# EAGLE design riser-1u-can (EAGLE 5.06)
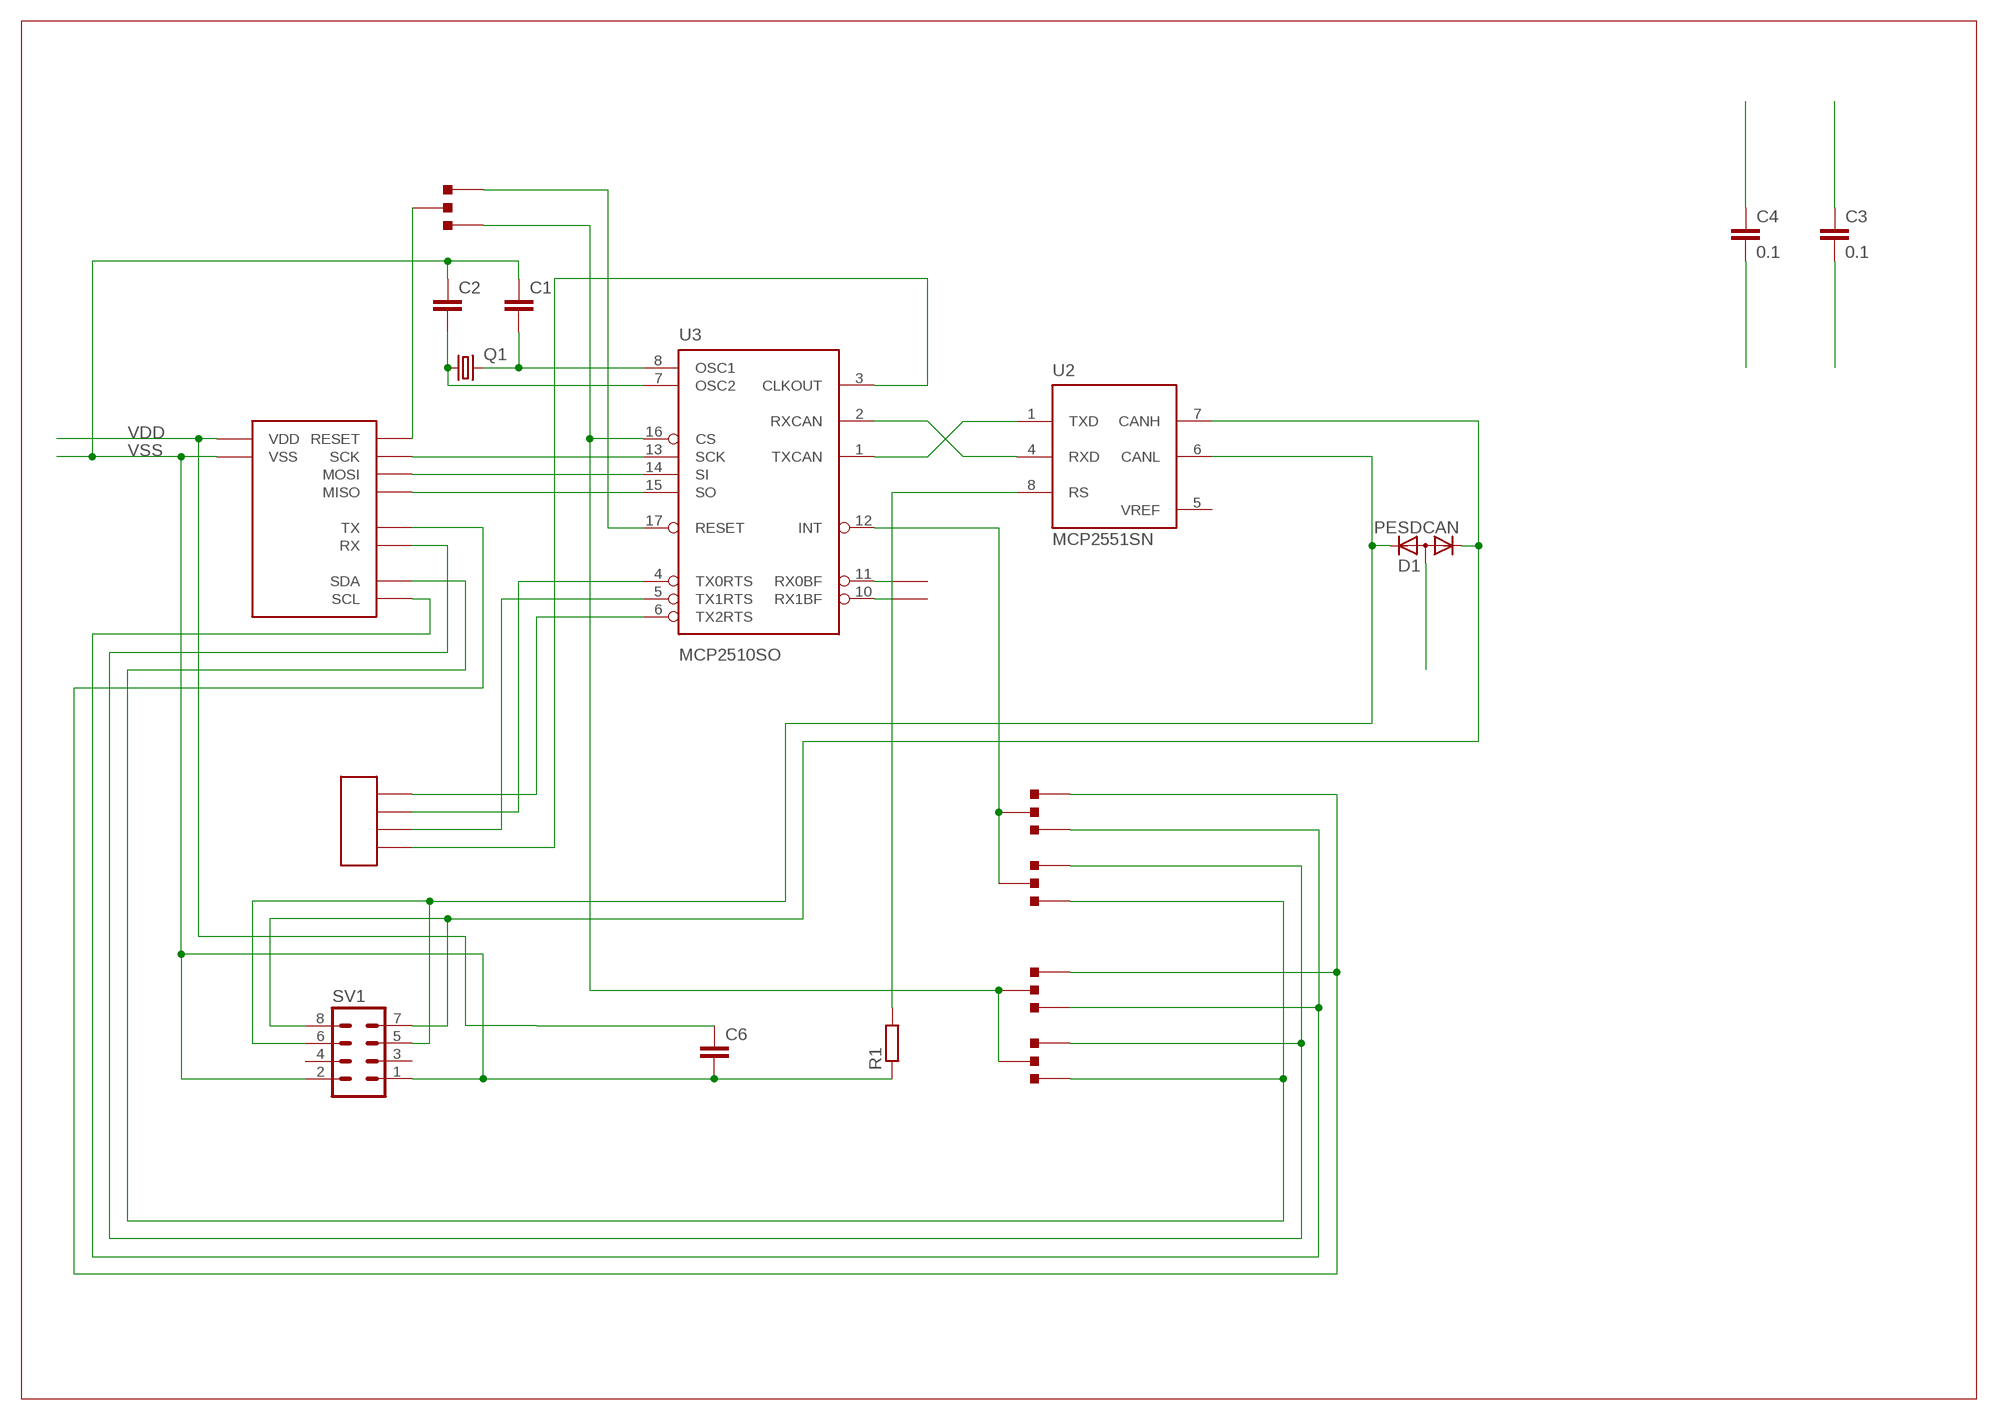
[diagram p0: schematic, sheet 1]

## Parts
C1  C-EUC0805  [C0805]
C2  C-EUC0805  [C0805]
C3  0.1  C-EUC0805  [C0805]
C4  0.1  C-EUC0805  [C0805]
C6  C-EUC1206  [C1206]
D1  PESDCAN  DIODE-2CA|ACSOT23  [SOT23]
Q1  CRYSTALHC49S  [HC49/S]
R1  R-EU_R0603  [R0603]
SV1  MA04-2  [MA04-2]
U2  MCP2551SN  [SO-08]
U3  MCP2510SO  [SO-18W]
U$1  UNI_BOARD_CONNECTOR_10  [UNI_BOARD_CONN_10]
U$2  PIN_HEADER_2X2  [PIN_HEADER_2X2]
U$3  JUMPER3  [JUMPER3]
U$4  JUMPER3  [JUMPER3]
U$5  JUMPER  [JUMPER]
U$7  JUMPER3  [JUMPER3]
U$8  JUMPER3  [JUMPER3]
U$10  JUMPER3  [JUMPER3]

## Nets
CANH: D1.1(K1) SV1.7 SV1.8 U2.7(CANH)
CANL: D1.2(K2) SV1.5 SV1.6 U2.6(CANL)
CS: U3.16(CS) U$7.P$1 U$8.P$1 U$10.P$3
INT: U3.12(INT) U$3.P$1 U$4.P$1
MISO: U3.15(SO) U$1.C$1(MISO)
MOSI: U3.14(SI) U$1.C$4(MOSI)
N$6: C1.2 Q1.2 U3.8(OSC1)
N$7: C2.2 Q1.1 U3.7(OSC2)
N$9: U3.3(CLKOUT) U$2.P$4
N$10: U3.5(TX1RTS) U$2.P$3
N$11: U3.4(TX0RTS) U$2.P$2
N$12: U3.6(TX2RTS) U$2.P$1
N$13: U3.11(RX0BF) U$5.P$1
N$14: U3.10(RX1BF) U$5.P$2
RESET: U$1.C$5(RESET) U$10.P$1
RESET_IN: U3.17(RESET) U$10.P$2
RS: R1.2 U2.8(RS)
RX: U$1.C$9(RX) U$4.P$2 U$8.P$2
RXCAN: U2.4(RXD) U3.2(RXCAN)
SCK: U3.13(SCK) U$1.C$3(SCK)
SCL: U$1.C$10(SCL) U$3.P$3 U$7.P$3
SDA: U$1.C$8(SDA) U$4.P$3 U$8.P$3
TX: U$1.C$7(TX) U$3.P$2 U$7.P$2
TXCAN: U2.1(TXD) U3.1(TXCAN)
VDD: C3.1 C4.1 C6.1 U$1.C$2(VDD)
VSS: C1.1 C2.1 C3.2 C4.2 C6.2 D1.3(A) R1.1 SV1.1 SV1.2 U$1.C$6(VSS)
Unconnected: SV1.3 SV1.4

## Power pins joined to a net without a drawn wire
VDD: U2.3(VDD) U3.18(VDD)
VREF: U2.5(VREF)
VSS: U2.2(VSS) U3.9(VSS)

## Library data of the parts
C1-C4 C6 = rcl:C-EU: CAPACITOR, European symbol
D1 = diode:DIODE-2CA|AC: Dual DIODE Cathode-Anode|Anode-Cathode
Q1 = crystal:CRYSTAL: CRYSTAL
R1 = rcl:R-EU_: RESISTOR, European symbol
SV1 = con-lstb:MA04-2: PIN HEADER
U2 = microchip_can:MCP2551: High Speed CAN tranceiver
U3 = my-microchip-can:MCP2510
U$1 = my-uni-board-conn:UNI_BOARD_CONNECTOR_10
U$2 = my:PIN_HEADER_2X2
U$3 U$4 U$7 U$8 U$10 = my:JUMPER3
U$5 = my:JUMPER

## Board
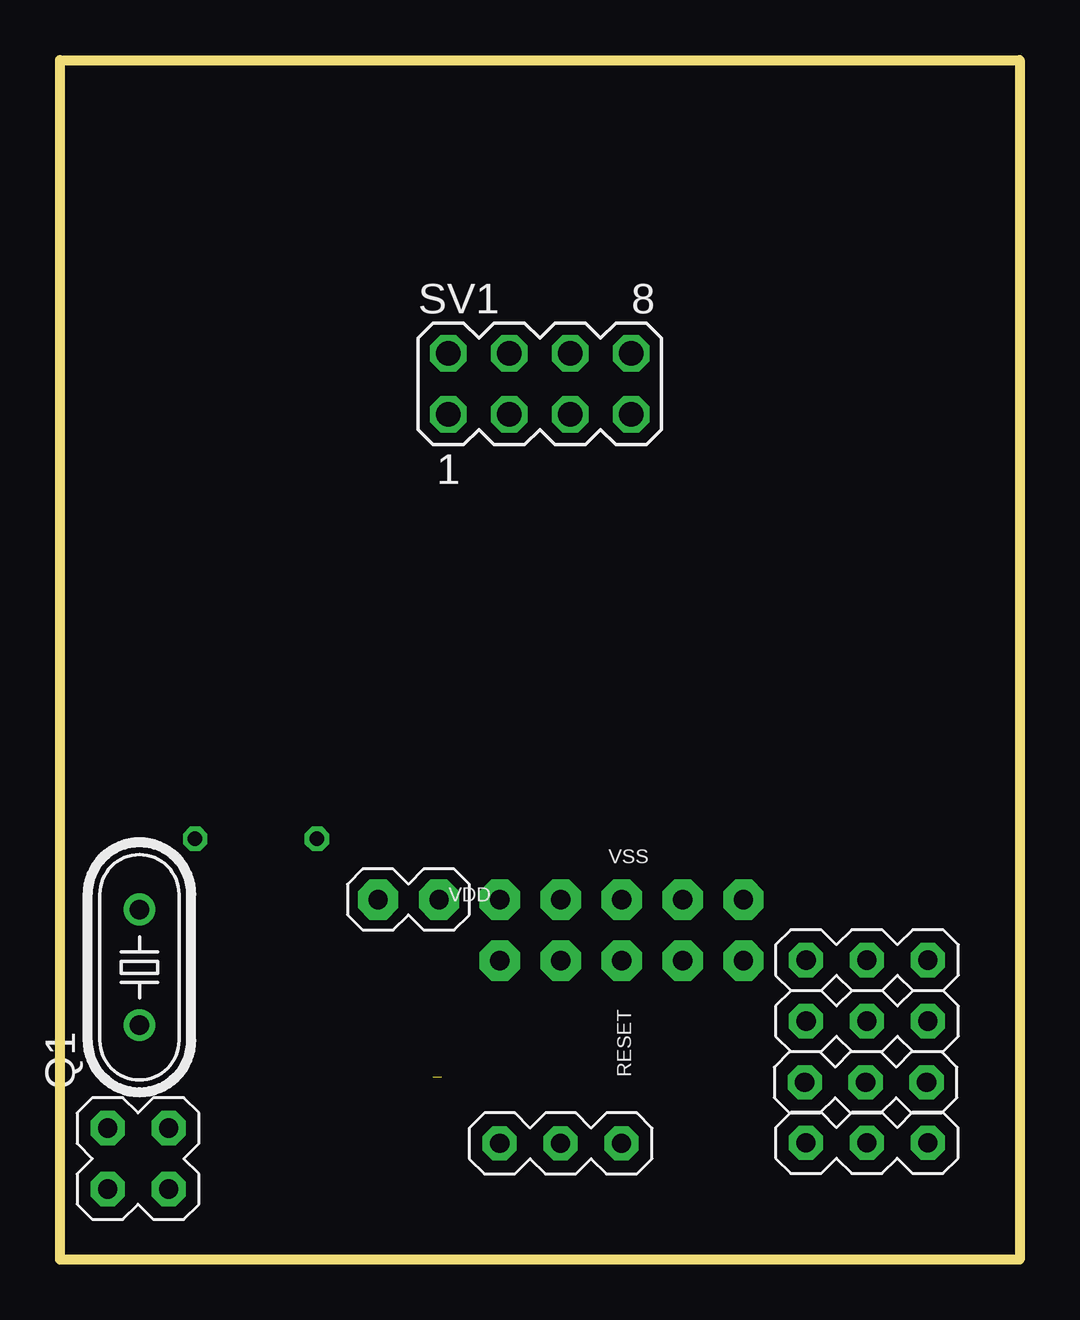
[diagram p1: board, top side]
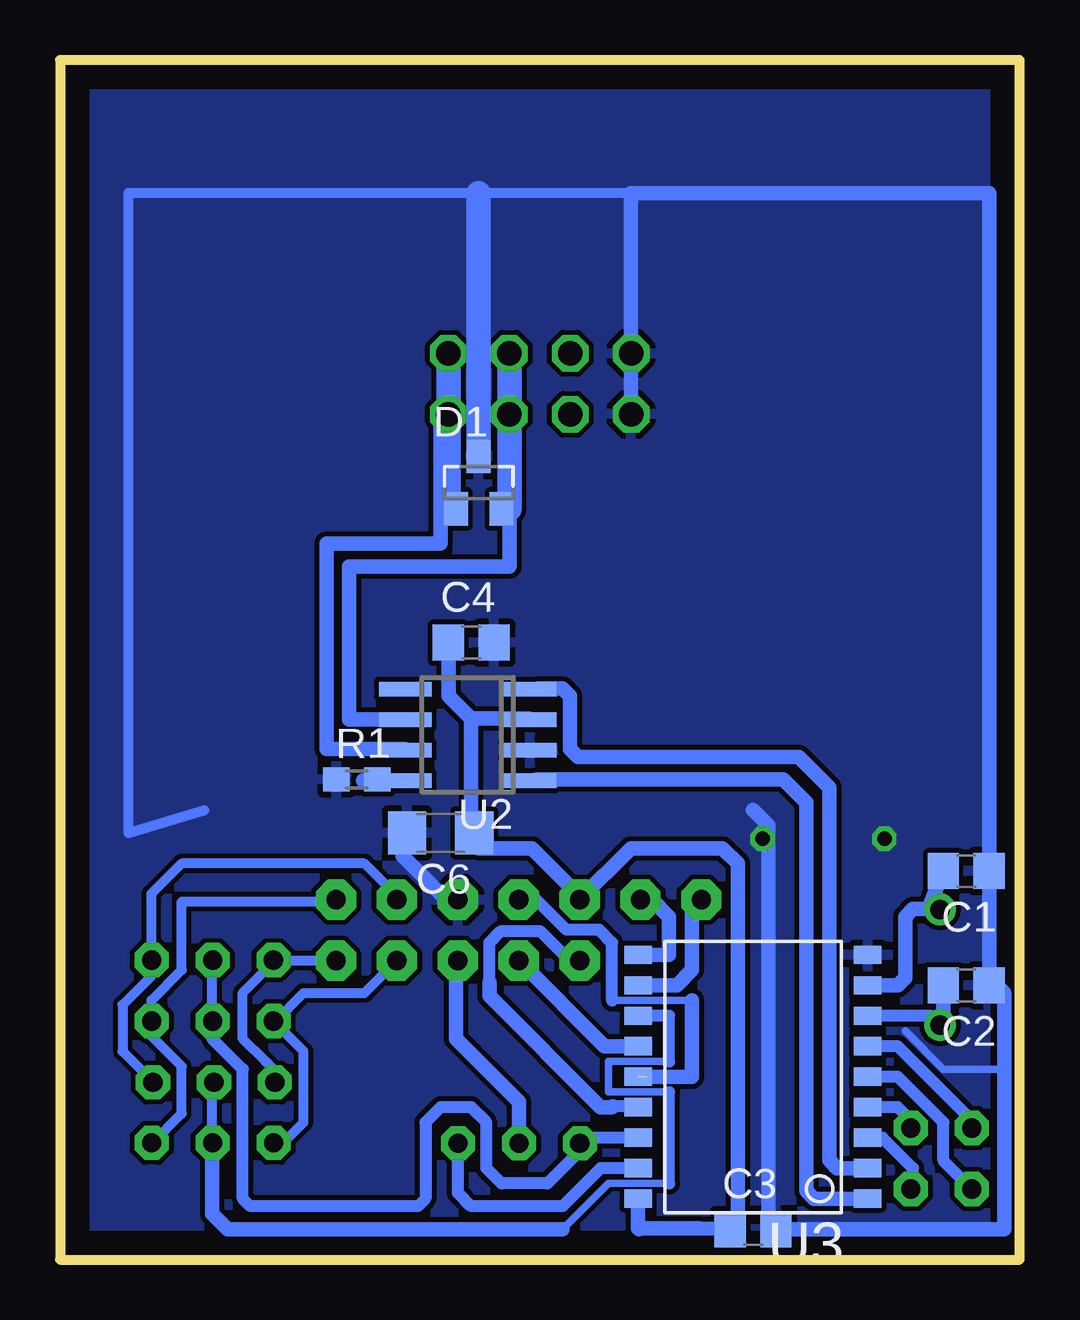
[diagram p2: board, bottom side, seen from below]

Size 40 x 50 mm. Coordinates in mm from the lower left corner, seen from the top.
Outline: 0,0 0,50 40,50 40,0 0,0
Copper layers (1*16): Top 0.035mm / dielectric 1.5mm / Bottom 0.035mm
Design rules "default": minimum track width 10mil, minimum drill 24mil, track to track 8mil, track to pad 8mil, pad to pad 8mil, via to via 8mil, smd to smd 8mil, copper to edge 40mil, drill to drill 8mil, minimum pad ring 10mil, minimum via ring 8mil, stop-mask expansion 4mil, vias tented up to drill 0mil, thermal gap 10mil

### Footprints (pad centres in the part's own frame; a part is rotated, then mirrored left to right if it is on the bottom)
C0805 = smd 1.3 x 1.5: 1 -0.95,0; 2 0.95,0
C1206 = smd 1.6 x 1.8: 1 -1.4,0; 2 1.4,0
SOT23 = smd 1 x 1.4: 1 -0.95,-1.1; 2 0.95,-1.1; 3 0,1.1
HC49/S = drill 0.813 round: 1 -2.413,0; 2 2.413,0
R0603 = smd 1.1 x 1: 1 -0.85,0; 2 0.85,0
MA04-2 = drill 1.016 octagon: 1 -3.81,-1.27; 2 -3.81,1.27; 3 -1.27,-1.27; 4 -1.27,1.27; 5 1.27,-1.27; 6 1.27,1.27; 7 3.81,-1.27; 8 3.81,1.27
SO-08 = smd 0.6 x 2.2: 1 -1.905,-2.6; 2 -0.635,-2.6; 3 0.635,-2.6; 4 1.905,-2.6; 5 1.905,2.6; 6 0.635,2.6; 7 -0.635,2.6; 8 -1.905,2.6
SO-18W = smd 0.762 x 1.143: 1 -5.08,-4.788; 2 -3.81,-4.788; 3 -2.54,-4.788; 4 -1.27,-4.788; 5 0,-4.788; 6 1.27,-4.788; 7 2.54,-4.788; 8 3.81,-4.788; 9 5.08,-4.788; 10 5.08,4.788; 11 3.81,4.788; 12 2.54,4.788; 13 1.27,4.788; 14 0,4.788; 15 -1.27,4.788; 16 -2.54,4.788; 17 -3.81,4.788; 18 -5.08,4.788
UNI_BOARD_CONN_10 = drill 0.8 pad 1.676 octagon: C$1 6.35,1.27; C$2 6.35,-1.27; C$3 3.81,1.27; C$4 3.81,-1.27; C$5 1.27,1.27; C$6 1.27,-1.27; C$7 -1.27,1.27; C$8 -1.27,-1.27; C$9 -3.81,1.27; C$10 -3.81,-1.27
PIN_HEADER_2X2 = drill 0.8 pad 1.422 octagon: P$1 -1.27,-1.27; P$2 -1.27,1.27; P$3 1.27,-1.27; P$4 1.27,1.27
JUMPER3 = drill 0.8 pad 1.422 octagon: P$1 0,0; P$2 0,2.54; P$3 0,-2.54
JUMPER = drill 0.8 pad 1.676 octagon: P$1 -1.27,0; P$2 1.27,0

### Placement (x,y rotation side)
C1  2.22,16.19 180 bottom
C2  2.22,11.43 180 bottom
C3  11.11,1.27 0 bottom
C4  22.86,25.72 0 bottom
C6  24.13,17.78 180 bottom
D1  22.54,32.38 0 bottom
Q1  3.31,12.18 90 top
R1  27.62,20 0 bottom
SV1  20,36.5 0 top
U2  23,21.87 90 bottom
U3  11.11,7.62 90 bottom
U$1  24.68,13.73 180 top
U$2  3.26,4.21 270 top
U$3  33.63,4.86 90 top
U$4  33.59,7.38 90 top
U$5  14.53,15 0 top
U$7  33.64,9.94 90 top
U$8  33.64,12.48 90 top
U$10  20.87,4.84 270 top

### Tracks (layer width: path | path; a pad name or v marks a point on that pad's centre or on a via)
CANH
  Bottom 0.406: SV1.7 23.81,35.24
  Bottom 0.61: 23.81,35.24 24.13,35.24 24.13,29.84 28.89,29.84 28.89,21.27 25.61,21.27 U2.7
  Bottom 1.016: 23.81,35.24 SV1.8 23.81,31.29 D1.1
CANL
  Bottom 0.406: SV1.5 21.27,35.24
  Bottom 0.61: U2.6 27.94,22.5 27.94,28.89 21.27,28.89 21.27,31.29 SV1.5
  Bottom 1.016: 21.27,35.24 SV1.6 21.27,31.29 D1.2
CS
  Bottom 0.406: U$8.P$1 33.66,12.48 33.66,9.94 U$7.P$1
  Bottom 0.508: U3.16 18.09,5.08 U$10.P$3 18.33,4.53 19.68,3.17 21.59,3.17 22.23,3.81 22.23,5.71 22.86,6.35 24.13,6.35 24.77,5.71 24.77,2.54 25.08,2.22 32.07,2.22 32.38,2.54 32.38,7.94 33.66,9.21 33.66,9.92 U$7.P$1
INT
  Bottom 0.305: 14.61,8.26 17.14,8.26 17.14,6.99 14.61,6.99 | 14.61,3.17 17.14,3.17 19.05,1.27
  Bottom 0.406: U$4.P$1 33.66,7.31 33.66,4.88 U$3.P$1
  Bottom 0.508: U3.12 14.61,10.16 14.61,8.26 | 14.61,3.17 14.61,6.99
  Bottom 0.61: 33.34,1.59 33.66,1.91 33.66,4.84 U$3.P$1 | 33.02,1.27 33.34,1.59 | 19.05,1.27 33.02,1.27 | 33.02,1.27 33.34,1.59
MISO
  Bottom 0.508: U$1.C$1 18.77,12.46 20,13.69 21.61,13.69 22.1,13.2 22.1,11.55 | 16.94,6.39 15.94,6.39 U3.15
  Bottom 0.61: 22.1,11.55 22.1,10.99 17.46,6.35 16.98,6.35 16.94,6.39
MOSI  (1 unrouted)
  Bottom 0.305: 13.65,10.79 16.99,10.79
  Bottom 0.508: 16.99,10.79 16.99,13.21 17.52,13.74 18.88,13.74 20.14,15 U$1.C$4
  Bottom 0.61: 15.56,7.62 13.65,7.62 13.65,10.79
N$1  (via drill 0.6)
  other vias: 13.26,15.01
N$6
  Bottom 0.61: U3.8 5.08,11.43 4.76,11.75 4.76,14.29 4.45,14.61 3.81,14.61 | 3.81,14.61 3.33,14.61 Q1.2 | C1.2 3.81,14.61
N$7
  Bottom 0.508: U3.7 3.71,10.16 Q1.1
  Bottom 0.61: C2.2 3.17,9.91 Q1.1
N$9
  Bottom 0.508: U3.3 5.71,5.08 4.45,3.81 4.45,3.02 U$2.P$4
N$10
  Bottom 0.508: U3.5 5.08,7.62 3.17,5.71 3.17,4.12 U$2.P$3
N$11
  Bottom 0.508: U$2.P$2 4.53,5.8 5.08,6.35 U3.4
N$12
  Bottom 0.508: U3.6 5.08,8.89 1.91,5.71 1.91,5.56 U$2.P$1
N$13
  Bottom 0.61: U3.11 14.29,11.43 13.65,12.06 13.65,14.61 U$5.P$1
N$14
  Bottom 0.61: U$5.P$2 15.32,15 14.61,14.29 14.61,12.7 U3.10
RESET
  Bottom 0.61: U$10.P$1 20.87,6.58 23.5,9.21 23.5,12.38 U$1.C$5
RESET_IN
  Bottom 0.508: U$10.P$2 23.41,2.77 22.86,2.22 19.05,2.22 17.46,3.81 U3.17
RS
  Bottom 0.61: U2.8 27.37,19.96 R1.2
RX
  Bottom 0.406: 31.1,12.4 U$8.P$2 | U$1.C$9 31.04,12.46 31.1,12.4 | 31.1,12.4 32.38,11.11 32.38,9.21 31.43,8.26 31.11,7.94 31.11,7.31 U$4.P$2
RXCAN
  Bottom 0.61: U3.2 7.62,3.81 7.94,4.13 7.94,19.68 9.21,20.95 18.41,20.95 18.73,21.27 18.73,23.5 19.05,23.81 19.73,23.81 20.05,23.81 U2.4
SCK
  Bottom 0.61: U3.13 17.3,8.89 U$1.C$3
SCL
  Bottom 0.406: U$1.C$10 28.57,14.92 34.92,14.92 34.92,12.06 36.18,10.81 U$7.P$3 36.18,9.31 34.92,8.05 34.92,6.09 U$3.P$3
SDA
  Bottom 0.406: U$1.C$8 25.95,15.16 27.3,16.51 34.92,16.51 36.2,15.24 36.2,12.7 36.18,12.69 U$8.P$3 36.18,11.83 37.39,10.62 37.39,8.67 36.12,7.41 U$4.P$3
TX
  Bottom 0.406: U$1.C$7 27.3,11.11 29.84,11.11 31.02,9.94 U$7.P$2 29.84,8.68 29.84,5.71 30.8,4.76 31.11,4.76 31.11,4.84 U$3.P$2
TXCAN
  Bottom 0.61: U3.1 8.57,2.54 8.89,2.86 8.89,19.05 9.84,20 20.12,20 | 20.12,20 U2.1 20.12,20
VDD
  Bottom 0.406: 20.32,22.54 20.36,22.5 U2.3 20.44,22.54 20.46,22.56 20.49,22.53
  Bottom 0.61: 15.9,1.29 U3.18 | 15.9,1.29 15.88,1.27 | 15.9,1.29 13.36,1.29 C3.1 11.75,1.9 11.75,16.51 12.38,17.14 16.19,17.14 U$1.C$2 18.34,15.16 20.32,17.14 22.54,17.14 23.18,17.78 22.54,18.41 22.54,17.97 C6.1 22.86,17.91 22.86,22.54 | 20.44,22.54 U2.3 20.44,22.54 | C4.1 23.81,23.49 22.86,22.54 | 22.86,22.54 20.44,22.54
VSS  (via drill 0.6)
  Bottom 0.305: 0.64,7.94 3.17,7.94 4.76,9.53
  Bottom 0.406: 33.97,18.73 37.15,17.78 37.15,44.45 22.54,44.45 16.19,44.45 | SV1.2 16.19,37.78 SV1.2
  Bottom 0.61: C2.1 0.95,11.43 0.79,11.27 | 0.79,11.27 0.64,11.11 0.64,8.57 0.64,7.94 0.64,1.27 C3.2 10.48,1.9 10.48,18.1 11.11,18.73 | 0.79,11.27 C2.1 1.27,15.88 1.59,16.19 C1.1 1.27,16.83 1.27,44.45 16.19,44.45 SV1.2 SV1.1 | U$1.C$6 23.41,15.16 24.05,15.16 25.72,16.83 25.72,17.46 26.04,17.78
  Bottom 1.016: 22.54,44.45 D1.3
  other vias: 10.71,17.54 5.63,17.54
  pour Bottom: 0,0 40.01,0 40.01,49.85 0,49.85

### Text on the board
tPlace: VSS | VDD | RESET
tOrigins: NOTE: HARDLY FITS 1U DIN RAIL CASE | (BETTER TO MOVE U2 TO OTHER SIDE) | VSS | VDD | VDD | MOSI | VSS | SDA | SCL | TX | RX | MISO | SCK | RESET | SDA | SCL | CS | RX | CS | TX | RESET | RESET_IN | INT | INT